# Altium schematic sheet GameBoy_Schematic.SchDoc
size A4; SheetNumber: 1; SheetTotal: 1
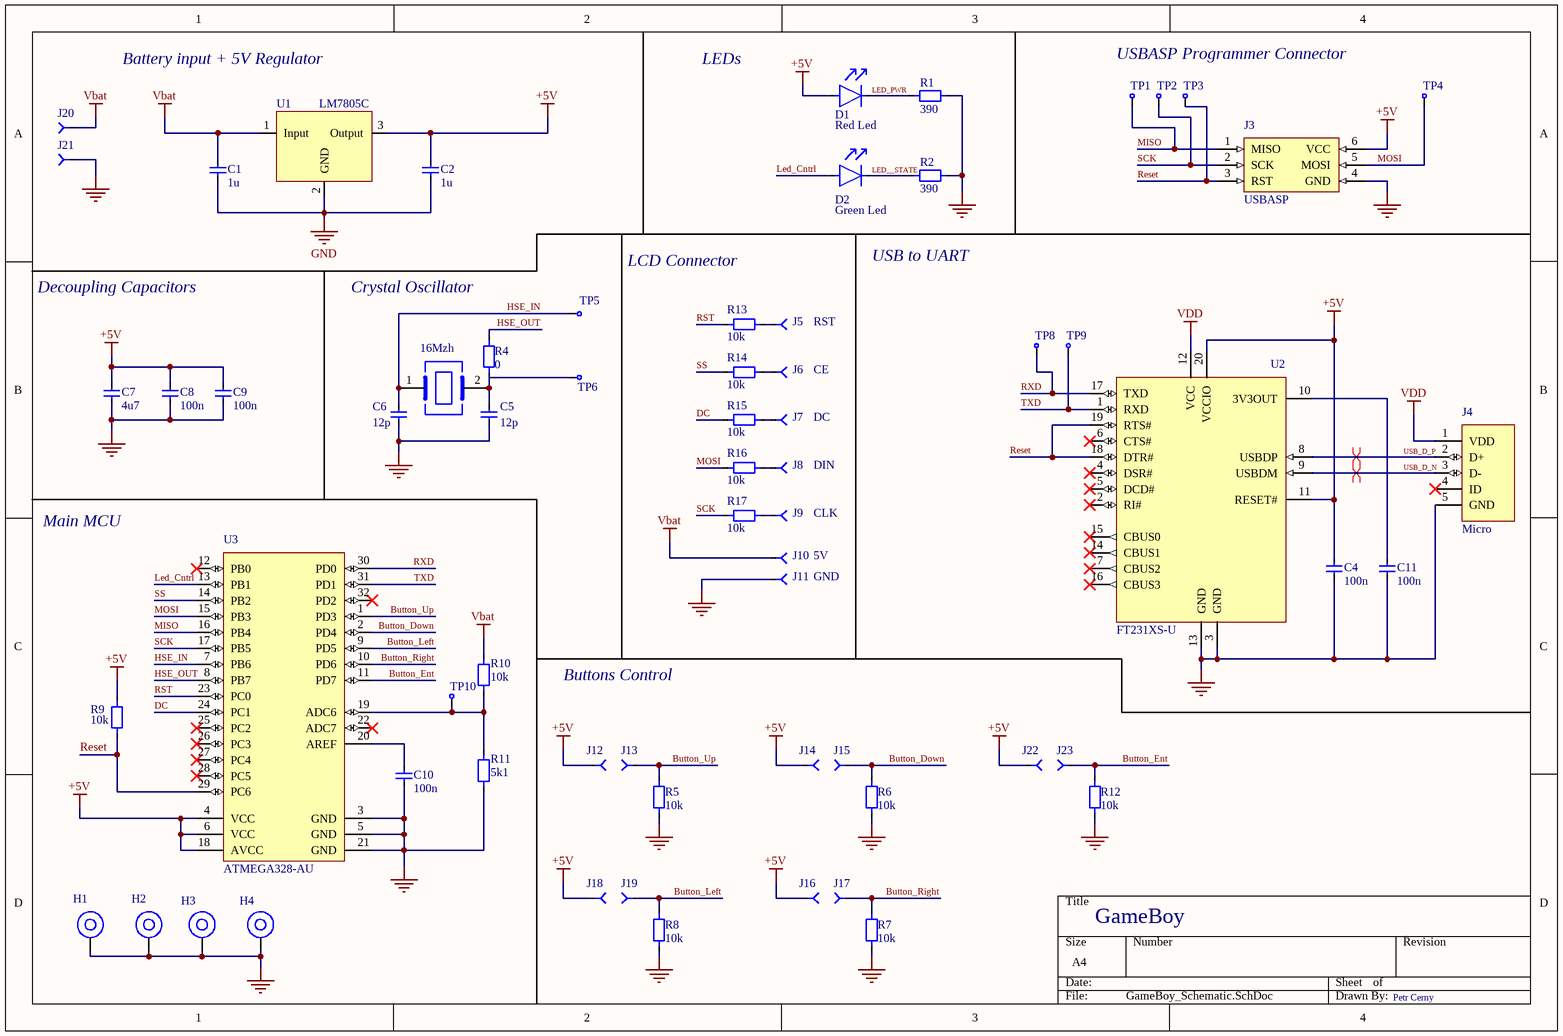
[diagram p0: GameBoy_Schematic.SchDoc]

## Parts
16Mzh  Crystal_Oscillator  [CrystalOscillator]  (value not drawn)
C1  1u  [CAP_0603]
C2  1u  [CAP_0603]
C4  100n  [CAP_0603]
C5  12p  [CAP_0603]
C6  12p  [CAP_0603]
C7  4u7  [CAP_0603]
C8  100n  [CAP_0603]
C9  100n  [CAP_0603]
C10  100n  [CAP_0603]
C11  100n  [CAP_0603]
D1  Red Led  [RED_LED]
D2  Green Led  [GREEN_LED]
H1  MountingHole  [MountinHoleM3]  (value not drawn)
H2  MountingHole  [MountinHoleM3]  (value not drawn)
H3  MountingHole  [MountinHoleM3]  (value not drawn)
H4  MountingHole  [MountinHoleM3]  (value not drawn)
J3  USBASP  [AVR_ISP]
J4  Micro  [USB_B_Micro]
J5  RST  [Pad_2.5mm]
J6  CE  [Pad_2.5mm]
J7  DC  [Pad_2.5mm]
J8  DIN  [Pad_2.5mm]
J9  CLK  [Pad_2.5mm]
J10  5V  [Pad_2.5mm]
J11  GND  [Pad_2.5mm]
J12  SolderPad  [Pad_2.5mm]  (value not drawn)
J13  SolderPad  [Pad_2.5mm]  (value not drawn)
J14  SolderPad  [Pad_2.5mm]  (value not drawn)
J15  SolderPad  [Pad_2.5mm]  (value not drawn)
J16  SolderPad  [Pad_2.5mm]  (value not drawn)
J17  SolderPad  [Pad_2.5mm]  (value not drawn)
J18  SolderPad  [Pad_2.5mm]  (value not drawn)
J19  SolderPad  [Pad_2.5mm]  (value not drawn)
J20  SolderPad  [Pad_2.5mm]  (value not drawn)
J21  SolderPad  [Pad_2.5mm]  (value not drawn)
J22  SolderPad  [Pad_2.5mm]  (value not drawn)
J23  SolderPad  [Pad_2.5mm]  (value not drawn)
R1  390  [RES_0603]
R2  390  [RES_0603]
R4  0  [RES_0603]
R5  10k  [RES_0603]
R6  10k  [RES_0603]
R7  10k  [RES_0603]
R8  10k  [RES_0603]
R9  10k  [RES_0603]
R10  10k  [RES_0603]
R11  5k1  [RES_0603]
R12  10k  [RES_0603]
R13  10k  [RES_0603]
R14  10k  [RES_0603]
R15  10k  [RES_0603]
R16  10k  [RES_0603]
R17  10k  [RES_0603]
TP1  TestPoint  [Pad_2.5mm]  (value not drawn)
TP2  TestPoint  [Pad_2.5mm]  (value not drawn)
TP3  TestPoint  [Pad_2.5mm]  (value not drawn)
TP4  TestPoint  [Pad_2.5mm]  (value not drawn)
TP5  TestPoint  [Pad_2.5mm]  (value not drawn)
TP6  TestPoint  [Pad_2.5mm]  (value not drawn)
TP8  TestPoint  [Pad_2.5mm]  (value not drawn)
TP9  TestPoint  [Pad_2.5mm]  (value not drawn)
TP10  TestPoint  [Pad_2.5mm]  (value not drawn)
U1  LM7805C  [LM7805C]
U2  FT231XS-U  [SSOP-20]
U3  ATMEGA328-AU  [TQFP-32]

## Nets
+5V: C2.2 C4.2 C7.2 C8.2 C9.1 D1.1 J3.6(VCC) J12.1 J14.1 J16.1 J18.1 J22.1 R9.2 U1.3(Output) U2.11(RESET#) U2.20(VCCIO) U3.4(VCC) U3.6(VCC) U3.18(AVCC)
GND: C1.1 C2.1 C4.1 C5.2 C6.1 C7.1 C8.1 C9.2 C10.1 C11.1 H1.1 H2.1 H3.1 H4.1 J3.4(GND) J4.5(GND) J11.1 J21.1 R1.2 R2.2 R5.1 R6.1 R7.1 R8.1 R11.1 R12.1 U1.2(GND) U2.3(GND) U2.13(GND) U3.3(GND) U3.5(GND) U3.21(GND)
Vbat: C1.2 J10.1 J20.1 R10.2 U1.1(Input)
VDD: J4.1(VDD) U2.12(VCC)
Button_Down: J15.1 R6.2 U3.2(PD4)
Button_Ent: J23.1 R12.2 U3.11(PD7)
Button_Left: J19.1 R8.2 U3.9(PD5)
Button_Right: J17.1 R7.2 U3.10(PD6)
Button_Up: J13.1 R5.2 U3.1(PD3)
DC: R15.1 U3.24(PC1)
HSE_IN: 16Mzh.1 C6.2 TP5.1 U3.7(PB6)
HSE_OUT: R4.2 U3.8(PB7)
LED__STATE: D2.2 R2.1
Led_Cntrl: D2.1 U3.13(PB1)
LED_PWR: D1.2 R1.1
MISO: J3.1(MISO) TP1.1 U3.16(PB4)
MOSI: J3.5(MOSI) R16.1 TP4.1 U3.15(PB3)
Reset: J3.3(RST) R9.1 TP3.1 U2.18(DTR#) U2.19(RTS#) U3.29(PC6)
RST: R13.1 U3.23(PC0)
RXD: TP8.1 U2.17(TXD) U3.30(PD0)
SCK: J3.2(SCK) R17.1 TP2.1 U3.17(PB5)
SS: R14.1 U3.14(PB2)
TXD: TP9.1 U2.1(RXD) U3.31(PD1)
USB_D_N: J4.3(D-) U2.9(USBDM)
USB_D_P: J4.2(D+) U2.8(USBDP)
Net16Mzh_2: 16Mzh.2 C5.1 R4.1 TP6.1
NetC10_2: C10.2 U3.20(AREF)
NetC11_2: C11.2 U2.10(3V3OUT)
NetJ5_1: J5.1 R13.2
NetJ6_1: J6.1 R14.2
NetJ7_1: J7.1 R15.2
NetJ8_1: J8.1 R16.2
NetJ9_1: J9.1 R17.2
NetR10_1: R10.1 R11.2 TP10.1 U3.19(ADC6)

Not connected (* = marked no-connect by the designer): J4 4(ID)*; U2 2(RI#)* 4(DSR#)* 5(DCD#)* 6(CTS#)* 7(CBUS2)* 14(CBUS1)* 15(CBUS0)* 16(CBUS3)*; U3 12(PB0)* 22(ADC7)* 25(PC2)* 26(PC3)* 27(PC4)* 28(PC5)* 32(PD2)*

## Layout directives
differential pair: USB_D_P
differential pair; net class USB_Diff: USB_D_N

## Notes on the sheet
- Battery input + 5V Regulator
- LEDs
- USBASP Programmer Connector
- Decoupling Capacitors
- (near R4) Crystal Oscillator
- LCD Connector
- USB to UART
- Main MCU
- Buttons Control
- GameBoy
- Petr Cerny

## Library data of the parts
C1 C2 = CAP_0603_16V: Capacitor SMD 0603 16V
C4-C6 C8-C11 = CAP_0603_50V: Capacitor SMD 0603 50V
C7 = CAP_0603_10V: Capacitor SMD 0603 10V
D1 = RED_LED
D2 = GREEN_LED
H1-H4 = MountingHole: Mounting Hole
J3 = AVR_ISP: Programmer connector
J4 = USB Micro B: USB B Micro; Manufacturer Part: 105017-0001; ComponentLink1Description: Kondik; ComponentLink1URL: https://www.kondik.cz/konektor-usb-2-0-micro-b-105017-0001/; ComponentLink2Description: Mouser; ComponentLink2URL: https://cz.mouser.com/ProductDetail/Molex/105017-0001?qs=hlXxxvYE36k7QcsR97GUKA%3D%3D; ComponentLink3Description: Datasheet; ComponentLink3URL: https://www.molex.com/content/dam/molex/molex-dot-com/products/automated/en-us/salesdrawingpdf/105/105017/1050170001_sd.pdf
J5-J11 = SolderPad
R1 R2 R4-R17 = RES_0603: Resistor SMD 0603
U2 = FT231XS-U: USB to UART; ComponentLink1Description: Mouser; ComponentLink1URL: https://cz.mouser.com/ProductDetail/FTDI/FT231XS-U?qs=Gp1Yz1mis3WFP7tMtj2Z9g%3D%3D; ComponentLink2Description: Datasheet; ComponentLink2URL: https://cz.mouser.com/datasheet/2/163/DS_FT231X-13571.pdf; Manufacturer Part: FT231XS-U
U3 = ATMEGA328-AU: MCU AVR 32K FLSH, 1K EE 2K SRAM - 20 MHz; ComponentLink1Description: Mouser; ComponentLink1URL: https://cz.mouser.com/ProductDetail/Microchip-Technology/ATMEGA328-AU?qs=lwdSMh1%2FoYJRHuGBjWz9Pg%3D%3D; ComponentLink2Description: Datasheet; ComponentLink2URL: https://cz.mouser.com/datasheet/2/268/ATmega48A_PA_88A_PA_168A_PA_328_P_DS_DS40002061B-3050139.pdf; Manufacturer: ATMEGA328-AU